# EAGLE schematic Komar (EAGLE 9.6.2)
Assembly variants: BASIC

## Sheet 1 of 2
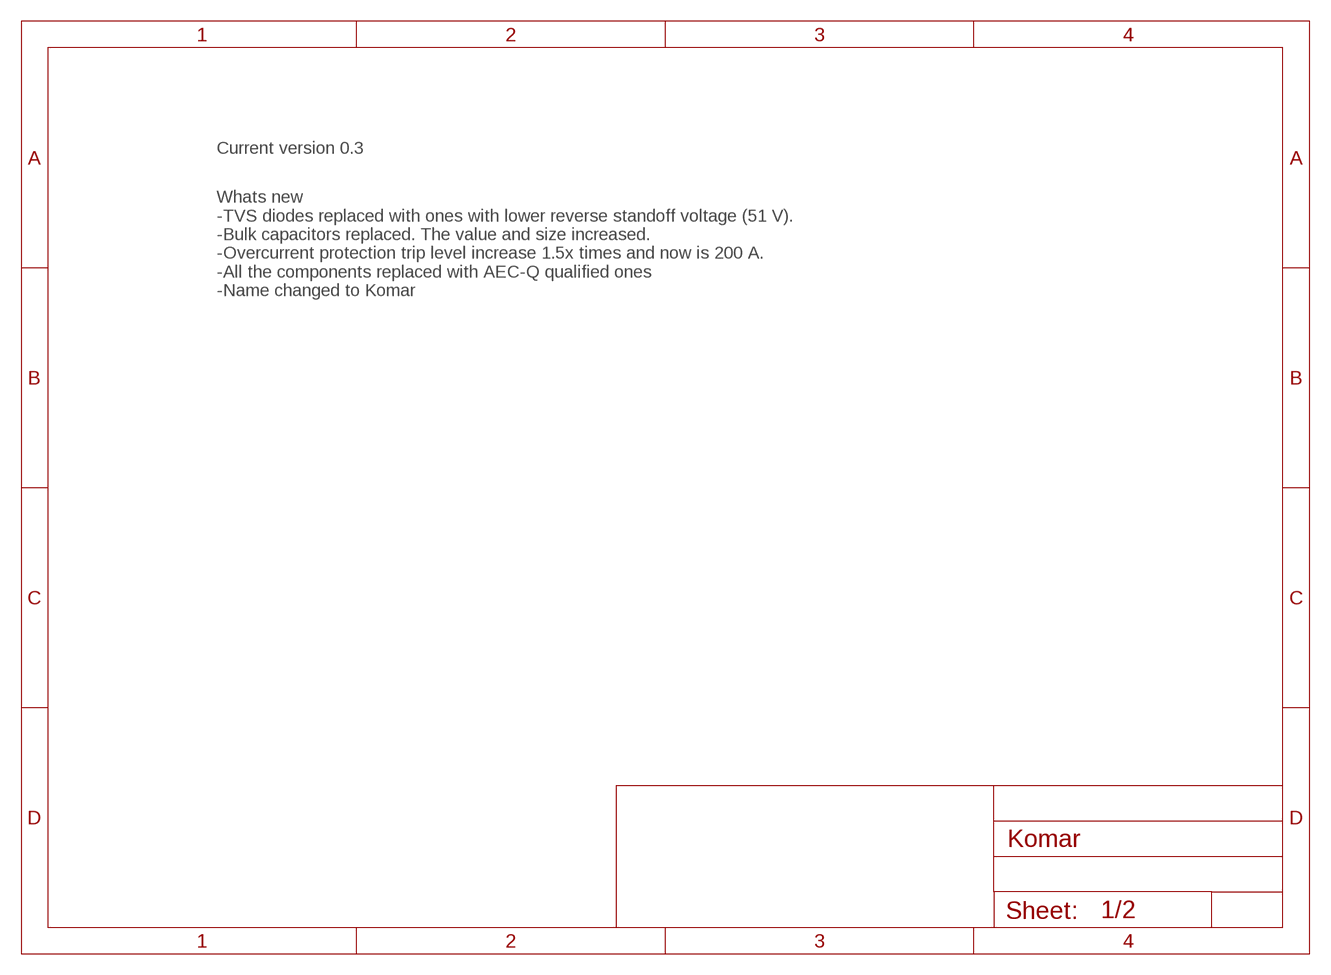
[diagram p0: schematic, sheet 1]

### Notes on the sheet
- Current version 0.3
- Whats new
  -TVS diodes replaced with ones with lower reverse standoff voltage (51 V).
  -Bulk capacitors replaced. The value and size increased.
  -Overcurrent protection trip level increase 1.5x times and now is 200 A.
  -All the components replaced with AEC-Q qualified ones
  -Name changed to Komar

## Sheet 2 of 2
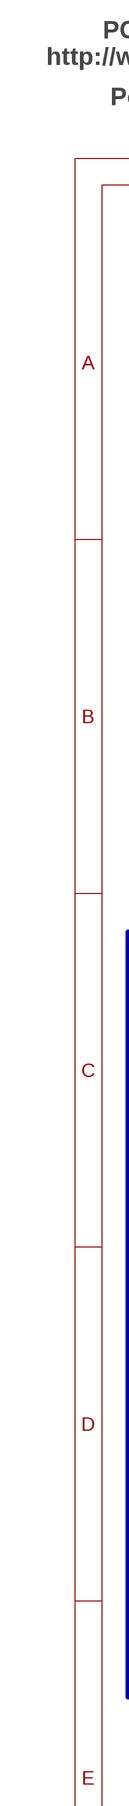
[diagram p1: schematic, sheet 2, part 1 of 2]
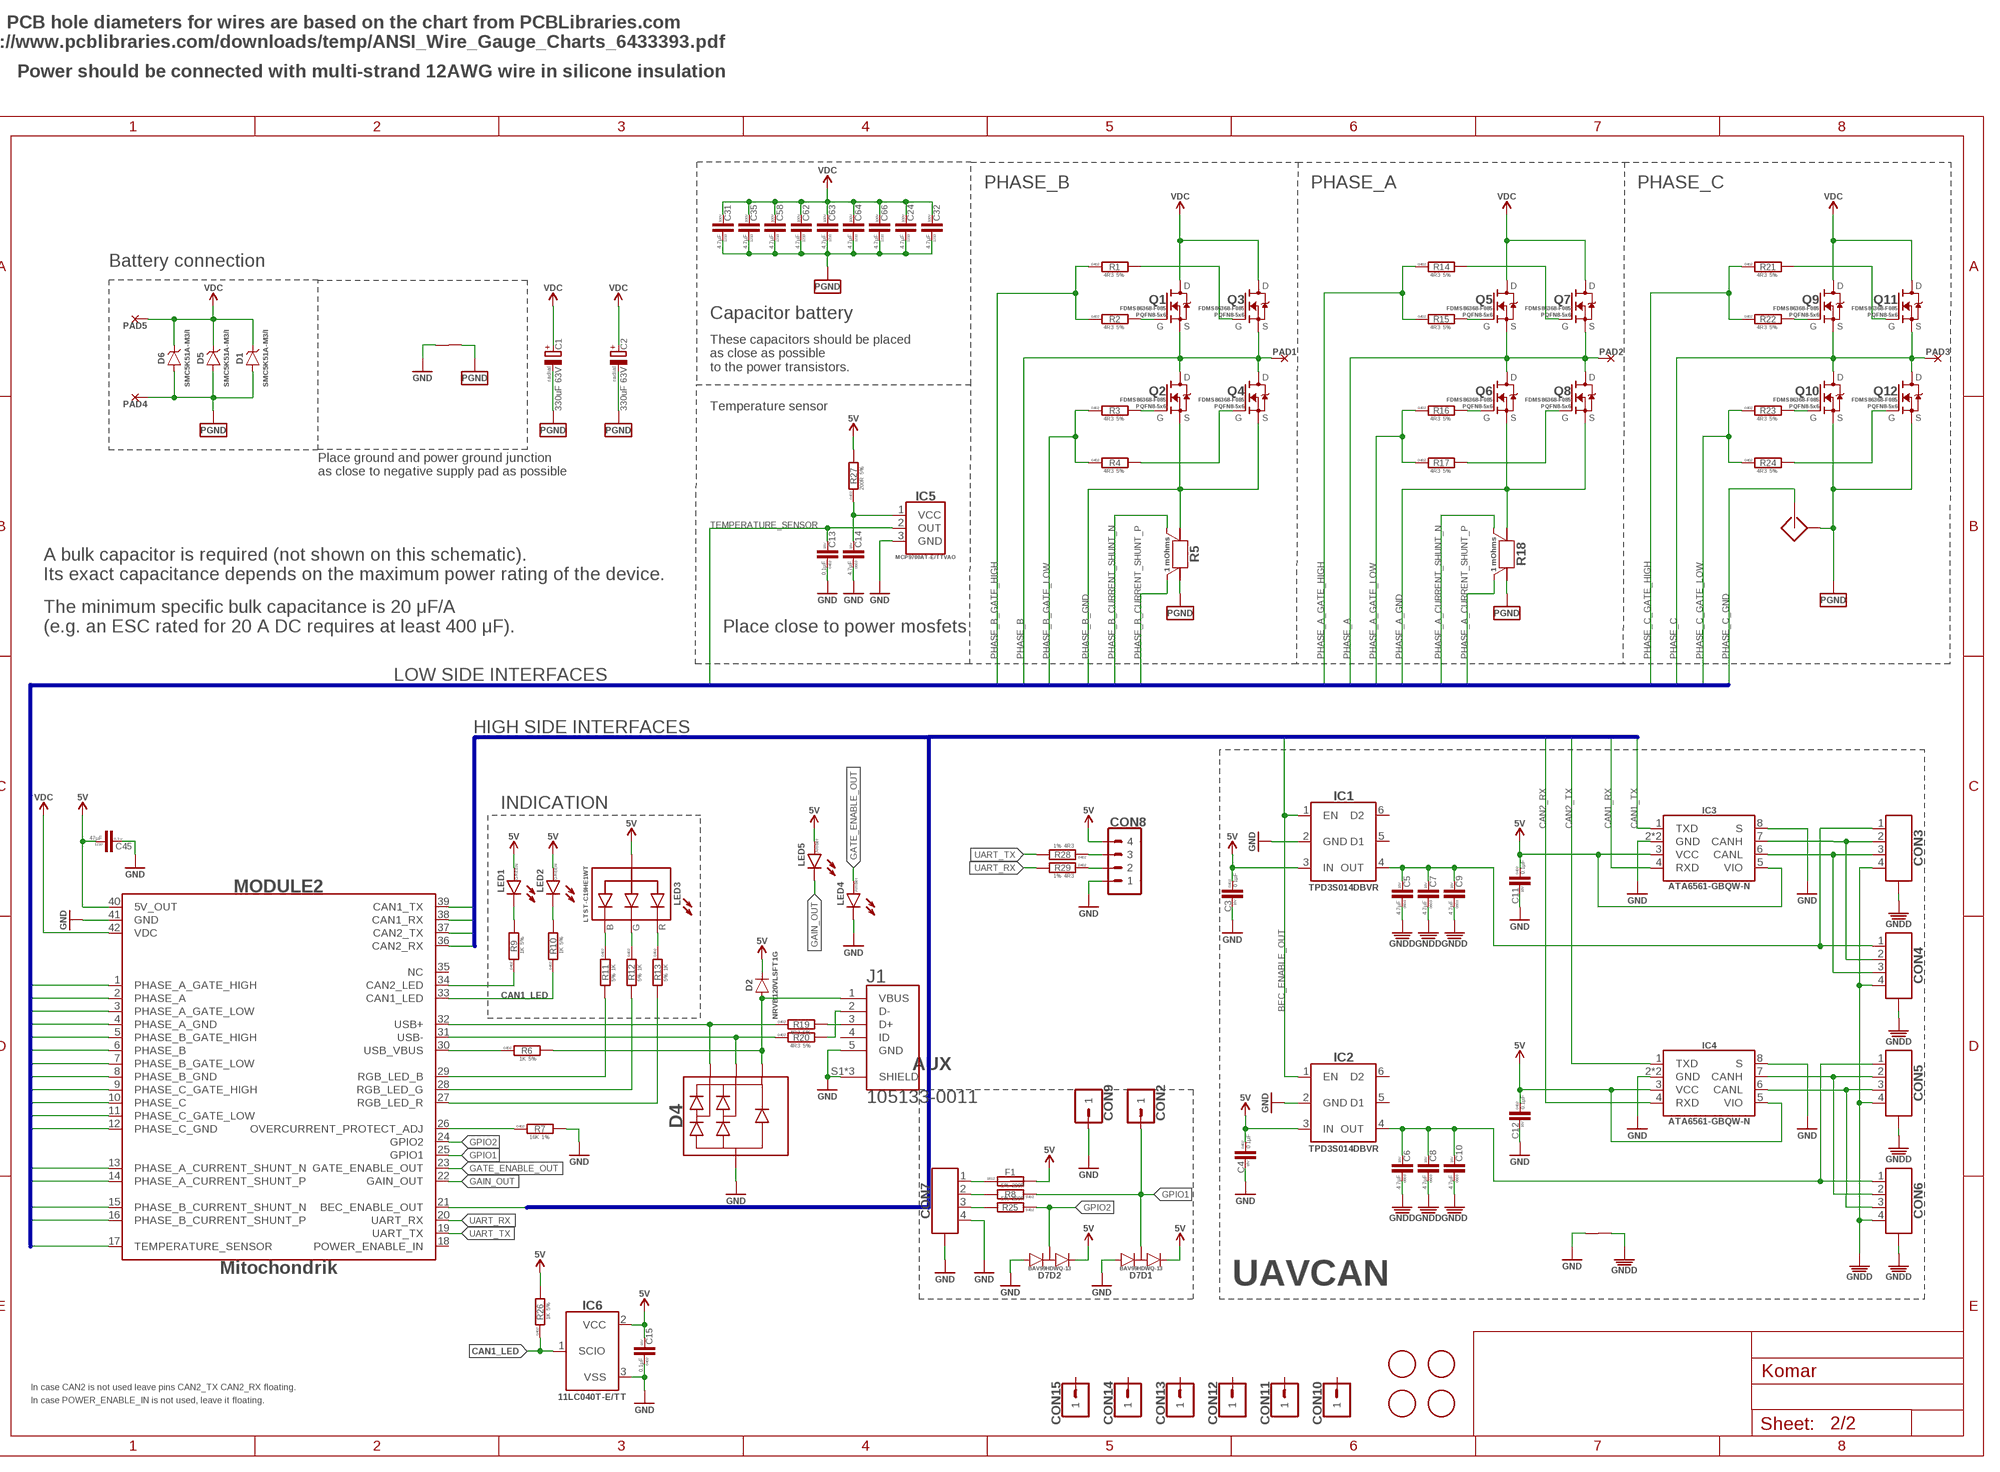
[diagram p2: schematic, sheet 2, part 2 of 2]

### Parts
C1  330uF 63V  CPOL-SIDE  [SIDE_10X22]
C2  330uF 63V  CPOL-SIDE  [SIDE_10X22]
C3  0.1µF  C-0402  [C0402]
C4  0.1µF  C-0402  [C0402]
C5  4.7µF  C-0603  [C0603]
C6  4.7µF  C-0603  [C0603]
C7  4.7µF  C-0603  [C0603]
C8  4.7µF  C-0603  [C0603]
C9  4.7µF  C-0603  [C0603]
C10  4.7µF  C-0603  [C0603]
C11  0.1µF  C-0402  [C0402]
C12  0.1µF  C-0402  [C0402]
C13  0.1µF  C-0402  [C0402]
C14  4.7µF  C-0603  [C0603]
C15  0.1µF  C-0402  [C0402]
C24  4.7µF  C-1210  [C1210]
C31  4.7µF  C-1210  [C1210]
C32  4.7µF  C-1210  [C1210]  (not fitted in variant BASIC)
C35  4.7µF  C-1210  [C1210]  (not fitted in variant BASIC)
C45  47µF  C-1210  [C1210]  (not fitted in variant BASIC)
C58  4.7µF  C-1210  [C1210]
C62  4.7µF  C-1210  [C1210]
C63  4.7µF  C-1210  [C1210]
C64  4.7µF  C-1210  [C1210]
C66  4.7µF  C-1210  [C1210]
CON2  PINHEAD_1X01-2  [1X01-PTH-2]  (not fitted in variant BASIC)
CON3  CON-4P-TABS-STRAIGHT  [JST_GH-4P-STRAIGHT]
CON4  CON-4P-TABS-STRAIGHT  [JST_GH-4P-STRAIGHT]
CON5  CON-4P-TABS-STRAIGHT  [JST_GH-4P-STRAIGHT]
CON6  CON-4P-TABS-STRAIGHT  [JST_GH-4P-STRAIGHT]
CON7  CON-4P-TABS-STRAIGHT  [JST_GH-4P-STRAIGHT]
CON8  PINHEAD_1X04-2  [1X04-PTH-2]  (not fitted in variant BASIC)
CON9  PINHEAD_1X01-2  [1X01-PTH-2]  (not fitted in variant BASIC)
CON10  PINHEAD_1X01-2  [1X01-PTH-2]  (not fitted in variant BASIC)
CON11  PINHEAD_1X01-2  [1X01-PTH-2]  (not fitted in variant BASIC)
CON12  PINHEAD_1X01-2  [1X01-PTH-2]  (not fitted in variant BASIC)
CON13  PINHEAD_1X01-2  [1X01-PTH-2]  (not fitted in variant BASIC)
CON14  PINHEAD_1X01-2  [1X01-PTH-2]  (not fitted in variant BASIC)
CON15  PINHEAD_1X01-2  [1X01-PTH-2]  (not fitted in variant BASIC)
D1  SMC5K51A-M3/I  [DO-214AB(SMC)]
D2  NRVB120VLSFT1G  [SOD123F]
D4  DRTR5V0U2SR-7  [SOT143B]
D5  SMC5K51A-M3/I  [DO-214AB(SMC)]  (not fitted in variant BASIC)
D6  SMC5K51A-M3/I  [DO-214AB(SMC)]  (not fitted in variant BASIC)
D7  BAV99HDWQ-13  [SOT363]
F1  FUSE-1812  [F1812]
IC1  TPD3S014DBVR-SOT23-6  [SOT26]
IC2  TPD3S014DBVR-SOT23-6  [SOT26]
IC3  ATA6561-GBQW-N-HVSON8  [SOT782-1]
IC4  ATA6561-GBQW-N-HVSON8  [SOT782-1]
IC5  MCP9700AT-E/TTVAO-SOT23  [SOT23B-3]
IC6  11LC040T-E/TT  [SOT23B-3]
J1  105133-0011  [MOLEX_105133-0011]
LED1  GREEN  LED-0402  [LED0402]
LED2  GREEN  LED-0402  [LED0402]
LED3  LTST-C19HE1WT  [0606]
LED4  ORANGE  LED-0402  [LED0402]
LED5  ORANGE  LED-0402  [LED0402]
MODULE2  MITOCHONDRIK_LV-TH  [MITOHONDRIK-TH]
PAD1  PAD-HOLE_2.4_SQUARE  [HOLE_2.4]  (not fitted in variant BASIC)
PAD2  PAD-HOLE_2.4_SQUARE  [HOLE_2.4]  (not fitted in variant BASIC)
PAD3  PAD-HOLE_2.4_SQUARE  [HOLE_2.4]  (not fitted in variant BASIC)
PAD4  PAD-HOLE_2.8_SQUARE  [HOLE_2.8]  (not fitted in variant BASIC)
PAD5  PAD-HOLE_2.8_SQUARE  [HOLE_2.8]  (not fitted in variant BASIC)
Q1  FDMS86368-F085  [PQFN8_5X6]
Q2  FDMS86368-F085  [PQFN8_5X6]
Q3  FDMS86368-F085  [PQFN8_5X6]
Q4  FDMS86368-F085  [PQFN8_5X6]
Q5  FDMS86368-F085  [PQFN8_5X6]
Q6  FDMS86368-F085  [PQFN8_5X6]
Q7  FDMS86368-F085  [PQFN8_5X6]
Q8  FDMS86368-F085  [PQFN8_5X6]
Q9  FDMS86368-F085  [PQFN8_5X6]
Q10  FDMS86368-F085  [PQFN8_5X6]
Q11  FDMS86368-F085  [PQFN8_5X6]
Q12  FDMS86368-F085  [PQFN8_5X6]
R1  4R3  R-5%-0402  [R0402]
R2  4R3  R-5%-0402  [R0402]
R3  4R3  R-5%-0402  [R0402]
R4  4R3  R-5%-0402  [R0402]
R5  1 mOhms  CURRENT_SHUNT_KELVIN-0.001R-2512-KELVIN  [R2512-KELVIN]
R6  1K  R-5%-0402  [R0402]
R7  16K  R-1%-0402  [R0402]
R8  200R  R-5%-0402  [R0402]
R9  1K  R-5%-0402  [R0402]
R10  1K  R-5%-0402  [R0402]
R11  1K  R-5%-0402  [R0402]
R12  1K  R-5%-0402  [R0402]
R13  1K  R-5%-0402  [R0402]
R14  4R3  R-5%-0402  [R0402]
R15  4R3  R-5%-0402  [R0402]
R16  4R3  R-5%-0402  [R0402]
R17  4R3  R-5%-0402  [R0402]
R18  1 mOhms  CURRENT_SHUNT_KELVIN-0.001R-2512-KELVIN  [R2512-KELVIN]
R19  4R3  R-5%-0402  [R0402]
R20  4R3  R-5%-0402  [R0402]
R21  4R3  R-5%-0402  [R0402]
R22  4R3  R-5%-0402  [R0402]
R23  4R3  R-5%-0402  [R0402]
R24  4R3  R-5%-0402  [R0402]
R25  200R  R-5%-0402  [R0402]
R26  1K  R-5%-0402  [R0402]
R27  200R  R-5%-0402  [R0402]
R28  4R3  R-1%-0402  [R0402]  (not fitted in variant BASIC)
R29  4R3  R-1%-0402  [R0402]  (not fitted in variant BASIC)
S1  SENSE  [SENSE-0.6]  (not fitted in variant BASIC)
U$1  CONNECTION-SMD  [CONNECTION]  (not fitted in variant BASIC)
U$3  CONNECTION-SMD  [CONNECTION]  (not fitted in variant BASIC)
U$5  FIDUCIALMOUNT  [FIDUCIA-MOUNT]  (not fitted in variant BASIC)
U$6  FIDUCIALMOUNT  [FIDUCIA-MOUNT]  (not fitted in variant BASIC)
U$7  FIDUCIALMOUNT  [FIDUCIA-MOUNT]  (not fitted in variant BASIC)
U$11  FIDUCIALMOUNT  [FIDUCIA-MOUNT]  (not fitted in variant BASIC)

### Nets
AGH1 [HV]: Q7.4(G) R14.2
AGH2 [HV]: Q5.4(G) R15.2
AGL1: Q8.4(G) R17.2
AGL2: Q6.4(G) R16.2
BEC_ENABLE_OUT: IC1.1(EN) IC2.1(EN) MODULE2.21(BEC_ENABLE_OUT)
BGH1 [HV]: Q3.4(G) R1.2
BGH2 [HV]: Q1.4(G) R2.2
BGL1: Q4.4(G) R4.2
BGL2: Q2.4(G) R3.2
CAN1_LED: IC6.1(SCIO) MODULE2.33(CAN1_LED) R10.1 R26.1
CAN1_RX: IC3.4(RXD) MODULE2.38(CAN1_RX)
CAN1_TX: IC3.1(TXD) MODULE2.39(CAN1_TX)
CAN1_VDD: C5.2 C7.2 C9.2 CON3.1 CON4.1 IC1.4(OUT)
CAN2_LED: MODULE2.34(CAN2_LED) R9.1
CAN2_RX: IC4.4(RXD) MODULE2.36(CAN2_RX)
CAN2_TX: IC4.1(TXD) MODULE2.37(CAN2_TX)
CAN2_VDD: C6.2 C8.2 C10.2 CON5.1 CON6.1 IC2.4(OUT)
CGH1 [HV]: Q11.4(G) R21.2
CGH2 [HV]: Q9.4(G) R22.2
CGL1: Q12.4(G) R24.2
CGL2: Q10.4(G) R23.2
GAIN_OUT: LED5.C MODULE2.22(GAIN_OUT)
GATE_ENABLE_OUT: LED4.A MODULE2.23(GATE_ENABLE_OUT)
GND: C3.2 C4.2 C11.2 C12.2 C13.1 C14.1 C15.1 C45.2 CON7.4 CON7.M$0(GND) CON7.M$1(GND) CON8.1 CON9.1 D4.1(C) D7.1(D1:A) D7.4(D2:A) IC1.2(GND) IC2.2(GND) IC3.2(GND) IC3.8(S) IC3.PAD(GND) IC4.2(GND) IC4.8(S) IC4.PAD(GND) IC5.3(GND) IC6.3(VSS) J1.5(GND) J1.S1(SHIELD) J1.S2(SHIELD) J1.S3(SHIELD) LED4.C MODULE2.41(GND) R7.2 U$1.P$1 U$3.P$1
GNDD: C5.1 C6.1 C7.1 C8.1 C9.1 C10.1 CON3.4 CON3.M$0(GND) CON3.M$1(GND) CON4.4 CON4.M$0(GND) CON4.M$1(GND) CON5.4 CON5.M$0(GND) CON5.M$1(GND) CON6.4 CON6.M$0(GND) CON6.M$1(GND) U$1.P$2
GPIO1: CON2.1 D7.6(D1:COMMON) MODULE2.25(GPIO1) R8.1
GPIO2: D7.3(D2:COMMON) MODULE2.24(GPIO2) R25.1
LED_BLUE: MODULE2.29(RGB_LED_B) R11.2
LED_GREEN: MODULE2.28(RGB_LED_G) R12.2
LED_RED: MODULE2.27(RGB_LED_R) R13.2
N$1: J1.3(D+) R19.2
N$2: J1.2(D-) R20.2
N$5: MODULE2.30(USB_VBUS) R6.1
N$6: CON7.1 F1.P$1
N$10: C14.2 IC5.1(VCC) R27.1
N$16: LED2.C R10.2
N$17: LED1.C R9.2
N$18: MODULE2.26(OVERCURRENT_PROTECT_ADJ) R7.1
N$19: CON7.2 R8.2
N$20: CON7.3 R25.2
N$21: CON3.2 CON4.2 IC3.7(CANH)
N$22: CON3.3 CON4.3 IC3.6(CANL)
N$25: CON8.3 R28.1
N$26: CON8.2 R29.1
N$44: CON5.3 CON6.3 IC4.6(CANL)
N$46: CON5.2 CON6.2 IC4.7(CANH)
N$51: D4.3(D2) MODULE2.31(USB-) R20.1
N$55: D4.2(D1) MODULE2.32(USB+) R19.1
N$58: LED3.R R13.1
N$59: LED3.G R12.1
N$60: LED3.B R11.1
PGND: C1.- C2.- C24.1 C31.1 C32.1 C35.1 C58.1 C62.1 C63.1 C64.1 C66.1 D1.A D5.A D6.A PAD4.1 Q10.1(S) Q10.2(S) Q10.3(S) Q12.1(S) Q12.2(S) Q12.3(S) R5.2 R5.22 R18.2 R18.22 S1.SHELL(SHELLL) U$3.P$2
PHASE_A [HV]: MODULE2.2(PHASE_A) PAD2.1 Q5.1(S) Q5.2(S) Q5.3(S) Q6.5(D) Q6.6(D) Q6.7(D) Q6.8(D) Q6.P$1(D) Q7.1(S) Q7.2(S) Q7.3(S) Q8.5(D) Q8.6(D) Q8.7(D) Q8.8(D) Q8.P$1(D)
PHASE_A_CURRENT_SHUNT_N: MODULE2.13(PHASE_A_CURRENT_SHUNT_N) R18.S1
PHASE_A_CURRENT_SHUNT_P: MODULE2.14(PHASE_A_CURRENT_SHUNT_P) R18.S2
PHASE_A_GATE_HIGH [HV]: MODULE2.1(PHASE_A_GATE_HIGH) R14.1 R15.1
PHASE_A_GATE_LOW: MODULE2.3(PHASE_A_GATE_LOW) R16.1 R17.1
PHASE_A_GND: MODULE2.4(PHASE_A_GND) Q6.1(S) Q6.2(S) Q6.3(S) Q8.1(S) Q8.2(S) Q8.3(S) R18.1 R18.11
PHASE_B [HV]: MODULE2.6(PHASE_B) PAD1.1 Q1.1(S) Q1.2(S) Q1.3(S) Q2.5(D) Q2.6(D) Q2.7(D) Q2.8(D) Q2.P$1(D) Q3.1(S) Q3.2(S) Q3.3(S) Q4.5(D) Q4.6(D) Q4.7(D) Q4.8(D) Q4.P$1(D)
PHASE_B_CURRENT_SHUNT_N: MODULE2.15(PHASE_B_CURRENT_SHUNT_N) R5.S1
PHASE_B_CURRENT_SHUNT_P: MODULE2.16(PHASE_B_CURRENT_SHUNT_P) R5.S2
PHASE_B_GATE_HIGH [HV]: MODULE2.5(PHASE_B_GATE_HIGH) R1.1 R2.1
PHASE_B_GATE_LOW: MODULE2.7(PHASE_B_GATE_LOW) R3.1 R4.1
PHASE_B_GND: MODULE2.8(PHASE_B_GND) Q2.1(S) Q2.2(S) Q2.3(S) Q4.1(S) Q4.2(S) Q4.3(S) R5.1 R5.11
PHASE_C [HV]: MODULE2.10(PHASE_C) PAD3.1 Q9.1(S) Q9.2(S) Q9.3(S) Q10.5(D) Q10.6(D) Q10.7(D) Q10.8(D) Q10.P$1(D) Q11.1(S) Q11.2(S) Q11.3(S) Q12.5(D) Q12.6(D) Q12.7(D) Q12.8(D) Q12.P$1(D)
PHASE_C_GATE_HIGH [HV]: MODULE2.9(PHASE_C_GATE_HIGH) R21.1 R22.1
PHASE_C_GATE_LOW: MODULE2.11(PHASE_C_GATE_LOW) R23.1 R24.1
PHASE_C_GND: MODULE2.12(PHASE_C_GND) S1.IN
TEMPERATURE_SENSOR: C13.2 IC5.2(OUT) MODULE2.17(TEMPERATURE_SENSOR)
UART_RX: MODULE2.20(UART_RX) R29.2
UART_TX: MODULE2.19(UART_TX) R28.2
USB_VBUS: D2.A D4.4(A) J1.1(VBUS) R6.2
VDC [HV]: C1.+ C2.+ C24.2 C31.2 C32.2 C35.2 C58.2 C62.2 C63.2 C64.2 C66.2 D1.C D5.C D6.C MODULE2.42(VDC) PAD5.1 Q1.5(D) Q1.6(D) Q1.7(D) Q1.8(D) Q1.P$1(D) Q3.5(D) Q3.6(D) Q3.7(D) Q3.8(D) Q3.P$1(D) Q5.5(D) Q5.6(D) Q5.7(D) Q5.8(D) Q5.P$1(D) Q7.5(D) Q7.6(D) Q7.7(D) Q7.8(D) Q7.P$1(D) Q9.5(D) Q9.6(D) Q9.7(D) Q9.8(D) Q9.P$1(D) Q11.5(D) Q11.6(D) Q11.7(D) Q11.8(D) Q11.P$1(D)
VDD_5V: C3.1 C4.1 C11.1 C12.1 C15.2 C45.1 CON8.4 D2.C D7.2(D1:C) D7.5(D2:C) F1.P$2 IC1.3(IN) IC2.3(IN) IC3.3(VCC) IC3.5(VIO) IC4.3(VCC) IC4.5(VIO) IC6.2(VCC) LED1.A LED2.A LED3.+(A) LED5.A MODULE2.40(5V_OUT) R26.2 R27.2 ; supply symbol labelled 5V
Unconnected: CON10.1 CON11.1 CON12.1 CON13.1 CON14.1 CON15.1 IC1.5(D1) IC1.6(D2) IC2.5(D1) IC2.6(D2) J1.4(ID) MODULE2.18(POWER_ENABLE_IN) MODULE2.35(NC)

### Buses
PHASE_A,PHASE_A_CURRENT_SHUNT_N,PHASE_A_CURRENT_SHUNT_P,PHASE_A_GATE_HIGH,PHASE_A_GATE_LOW,PHASE_A_GND,PHASE_B,PHASE_B_CURRENT_SHUNT_N,PHASE_B_CURRENT_SHUNT_P,PHASE_B_GATE_HIGH,PHASE_B_GATE_LOW,PHASE_B_GND,PHASE_C,PHASE_C_GATE_HIGH,PHASE_C_GATE_LOW,PHASE_C_GND,TEMPERATURE_SENSOR,TEMP_SENS
BEC_ENABLE_OUT,CAN1_RX,CAN1_TX,CAN2_RX,CAN2_TX

### Notes on the sheet
- PCB hole diameters for wires are based on the chart from PCBLibraries.com
  http://www.pcblibraries.com/downloads/temp/ANSI_Wire_Gauge_Charts_6433393.pdf
- Power should be connected with multi-strand 12AWG wire in silicone insulation
- PHASE_B | PHASE_A | PHASE_C
- Battery connection
- Capacitor battery
- These capacitors should be placed 
  as close as possible 
  to the power transistors.
- Temperature sensor
- Place ground and power ground junction
  as close to negative supply pad as possible
- A bulk capacitor is required (not shown on this schematic).
  Its exact capacitance depends on the maximum power rating of the device.
- The minimum specific bulk capacitance is 20 μF/A 
  (e.g. an ESC rated for 20 A DC requires at least 400 μF).
- Place close to power mosfets
- LOW SIDE INTERFACES
- HIGH SIDE INTERFACES
- INDICATION
- AUX
- UAVCAN
- In case CAN2 is not used leave pins CAN2_TX CAN2_RX floating.
- In case POWER_ENABLE_IN is not used, leave it floating.

## Library data of the parts
C1 C2 = mitohondrique:CPOL: Polar tantalum capacitor; AEC-Q: AEC-Q200; ALTERNATIVE: EEU-FC1J331B; DIGIKEY#: 565-2043-ND; LIFETIME: 7000 Hrs @ 105°C; MANF: United Chemi-Con; MANF#: ELXZ630ELL331MK20S; OPERATING_TEMP: -55°C ~ 105°C; PACKAGE: radial
C3 C4 C11 C12 = rc:C; AEC-Q: AEC-Q200; DIGIKEY#: 490-7998-1-ND; MANF: Murata Electronics; MANF#: GCM155R71C104KA55J; PACKAGE: 0402; VOLTAGE: 16V
C5-C10 C14 = rc:C; AEC-Q: AEC-Q200; DIGIKEY#: 490-12289-1-ND; MANF: Murata Electronics; MANF#: GRT188C81C475KE13D; OPERATING_TEMP: -55°C ~ 105°C; PACKAGE: 0603; VOLTAGE: 16V
C13 C15 = rc:C; AEC-Q: AEC-Q200; DIGIKEY#: 490-7998-1-ND; MANF: Murata Electronics; MANF#: GCM155R71C104KA55J; OPERATING_TEMP: -55°C ~ 125°C; PACKAGE: 0402; VOLTAGE: 16V
C24 C31 C32 C35 C58 C62-C64 C66 = rc:C; AEC-Q: AEC-Q200; DIGIKEY#: 490-14484-1-ND; MANF: Murata Electronics; MANF#: GCM32DC72A475KE02L; OPERATING_TEMP: -55°C ~ 125°C; PACKAGE: 1210; VOLTAGE: 100V
C45 = rc:C; ASSY: DNM; DIGIKEY#: 490-4844-1-ND; MANF: Murata Electronics; MANF#: GCM32ER70J476KE19L; OPERATING_TEMP: -55°C ~ 125°C; PACKAGE: 1210; VOLTAGE: 6.3 V
CON2 CON9-CON15 = pinhead:PINHEAD_1X01: pinheader 1P
CON3-CON7 = Connectors:CON-4P-TABS: Connector Receptacle 4 Position 0.049" (1.25mm) Tin Surface Mount; AEC-Q: ---; DIGIKEY#: 455-1580-2-ND; MANF: JST Sales America Inc; MANF#: BM04B-GHS-TBT(LF)(SN)(N); OPERATING_TEMP: -25°C ~ 85°C
CON8 = pinhead:PINHEAD_1X04
D1 = TVS_diodes:SMC5K51A-M3/I: TVS DIODE 51V 82.4V DO214AB; AEC-Q: AEC-Q101; DIGIKEY#: SMC5K51A-M3/IGICT-ND; MANF: Vishay Semiconductor Diodes Division; MANF#: SMC5K51A-M3/I; REVERS_STANDOFF_V: 51V
D2 = Diodes:NRVB120VLSFT1G: Diode Schottky 20V 1A Surface Mount SOD-123FL; AEC-Q: AEC-Q101; ALTERNATIVE: NRVB230LSFT1G; DIGIKEY#: NRVB120VLSFT1GOSCT-ND; MANF: ON Semiconductor; MANF#: NRVB120VLSFT1G; OPERATING_TEMP: -65°C ~ 125°C
D4 = TVS_diodes:DRTR5V0U2SR-7: Clamp Ipp Tvs Diode Surface Mount SOT-143; AEC-Q: AEC-Q101; DIGIKEY#: DRTR5V0U2SR-7DICT-ND; MANF: Diodes Incorporated; MANF#: DRTR5V0U2SR-7; OPERATING_TEMP: -65°C ~ 150°C (TJ)
D5 D6 = TVS_diodes:SMC5K51A-M3/I: TVS DIODE 51V 82.4V DO214AB; AEC-Q: AEC-Q101; ASSY: DNM; DIGIKEY#: SMC5K51A-M3/IGICT-ND; MANF: Vishay Semiconductor Diodes Division; MANF#: SMC5K51A-M3/I; REVERS_STANDOFF_V: 51V
D7 = Diodes:BAV99HDWQ-13: DIODE FS 100V 200MA SOT363; AEC-Q: AEC-Q101; DIGIKEY#: BAV99HDWQ-13DICT-ND; MANF: Diodes Incorporated; MANF#: BAV99HDWQ-13
F1 = rc:FUSE; AEC-Q: AEC-Q200; DIGIKEY#: MF-MSMF010-2CT-ND; HOLD_CURRENT: 100 mA; MANF: Bourns Inc.; MANF#: MF-MSMF010-2; PACKAGE: 1812; TIME_TO_TRIP: 1.5 S; TRIP_CURRENT: 300 mA
IC1 IC2 = misc:TPD3S014DBVR: Current Switch Regulator High-Side 500mA SOT-23-6; AEC-Q: ---; DIGIKEY#: 296-38835-1-ND; MANF: Texas Instruments; MANF#: TPD3S014DBVR; OPERATING_TEMP: -40°C ~ 85°C
IC3 IC4 = serial_interfaces:ATA6561-GBQW-N: 1/1 Transceiver Half CAN 8-HVSON (3x3); AEC-Q: AEC-Q100; ALTERNATIVE: TJA1441DTK/0Z; DATA_RATE: 5Mbps; DIGIKEY#: ATA6561-GBQW-NCT-ND; MANF: Microchip Technology; MANF#: ATA6561-GBQW-N; OPERATING_TEMP: -40°C ~ 150°C (TJ); VOLTAGE_SUPPLY: 4.5V ~ 5.5V
IC5 = misc:MCP9700: Temperature Sensor Analog, Local -40°C ~ 125°C 10mV/°C; AEC-Q: AEC-Q100; ALTERNATIVE: MCP9701T-E/TT; DIGIKEY#: MCP9700AT-E/TTVAOTR-ND; MANF: Microchip Technology; MANF#: MCP9700AT-E/TTVAO
IC6 = misc:11LC040T-E/TT: EEPROM Memory IC 4Kb (512 x 8) Single Wire 100kHz SOT-23-3; AEC-Q: ---; DIGIKEY#: 11LC040T-E/TTCT-ND; MANF: Microchip Technology; MANF#: 11LC040T-E/TT; OPERATING_TEMP: -40°C ~ 125°C (TA)
J1 = 105133-0011:105133-0011: Conn Micro USB Type B RCP 5 POS 0.65mm Solder ST SMD 5 Terminal 1 Port Embossed T/R; AEC-Q: ---; DIGIKEY#: WM10134TR-ND; MANF: Molex; MANF#: 105133-0011; OPERATING_TEMP: -35°C ~ 85°C
LED1 LED2 = rc:LED: SMD LED; AEC-Q: ---; COLOR: GREEN; DIGIKEY#: 1830-IN-S42BT5GCT-ND; MANF: Inolux; MANF#: IN-S42BT5G
LED3 = misc:LTST-C19HE1WT: LED RGB DIFFUSED CHIP SMD; AEC-Q: ---; DIGIKEY#: 160-2162-1-ND; MANF: Lite-On Inc; MANF#: LTST-C19HE1WT; OPERATING_TEMP: -20°C ~ +80°C
LED4 LED5 = rc:LED: SMD LED; AEC-Q: ---; COLOR: Amber; DIGIKEY#: 1830-IN-S42BT5ACT-ND; MANF: Inolux; MANF#: IN-S42BT5A
MODULE2 = zubax_modules:MITOCHONDRIK_LV; MANF: Zubax Robotics; MANF#: Mitochondrik
PAD1-PAD5 = PADS:PAD
Q1-Q12 = mosfet:FDMS86368-F085: N-Channel 80V 80A (Tc) 214W (Tc) Surface Mount Power56; AEC-Q: AEC-Q101; ALTERNATIVE: BSC080N12LSGATMA1; DIGIKEY#: FDMS86368-F085CT-ND; MANF: ON Semiconductor; MANF#: FDMS86368-F085; OPERATING_TEMP: -55°C ~ 175°C (TJ); PACKAGE: PQFN8-5x6
R1-R4 R14-R17 R19-R24 = rc:R; AEC-Q: AEC-Q200; DIGIKEY#: P4.3JCT-ND; MANF: Panasonic Electronic Components; MANF#: ERJ-2GEJ4R3X; OPERATING_TEMP: -55°C ~ 155°C; PACKAGE: 0402; TOLERANCE: 5%
R5 R18 = SHUNT_RESISTORS:CURRENT_SHUNT_KELVIN; AEC-Q: AEC-Q200; DIGIKEY#: CRE2512-FZ-R001E-3CT-ND; MANF: Bourns Inc.; MANF#: CRE2512-FZ-R001E-3; OPERATING_TEMP: -55°C ~ 170°C; POWER: 3W; TC: ±50ppm/°C; TOLERANCE: ±1%
R6 R9-R13 R26 = rc:R; AEC-Q: AEC-Q200; DIGIKEY#: P1.00KLCT-ND; MANF: Panasonic Electronic Components; MANF#: ERJ-2RKF1001X; OPERATING_TEMP: -55°C ~ 155°C; PACKAGE: 0402; TOLERANCE: 5%
R7 = rc:R; AEC-Q: AEC-Q200; DIGIKEY#: P124444CT-ND; MANF: Panasonic Electronic Components; MANF#: ERJ-PA2F1602X; PACKAGE: 0402; TOLERANCE: 1%
R8 R25 R27 = rc:R; AEC-Q: AEC-Q200; DIGIKEY#: P200JCT-ND; MANF: Panasonic Electronic Components; MANF#: ERJ-2GEJ201X; OPERATING_TEMP: -55°C ~ 155°C; PACKAGE: 0402; TOLERANCE: 5%
R28 R29 = rc:R; AEC-Q: 1; DIGIKEY#: 2; PACKAGE: 0402; TOLERANCE: 1%
S1 = misc:SENSE; BOM: EXCLUDE
U$1 U$3 = misc:CONNECTION; BOM: EXCLUDE
U$5-U$7 U$11 = misc:FIDUCIALMOUNT; BOM: EXCLUDE

## Net classes
1 HV: clearance 0.25 mm to class 0, clearance 0.25 mm